# EAGLE schematic bottom (EAGLE 7.7.0)
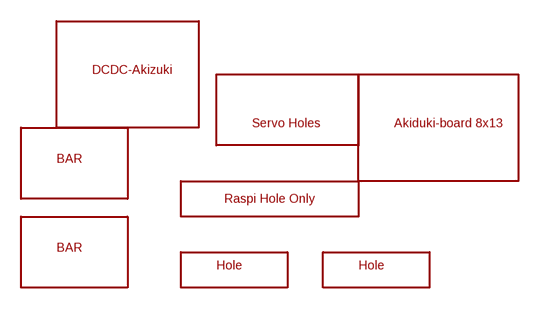
[diagram p0: schematic, sheet 1]

## Parts
U$1  RPI3-HOLE-ONLY  [RPI3-HOLE-ONLY]
U$2  SQUARE_LONG_HOLE  [SQUARE_LONG_HOLE]
U$3  SQUARE_LONG_HOLE  [SQUARE_LONG_HOLE]
U$12  BAR  [BAR]
U$13  BAR  [BAR]
U$14  SERVO-HOLES  [SERVO-HOLES]
U$18  DCDC-AKIZUKI  [DCDC_AKIZUKI]
U$19  AKIDUKI-BOARD8X13  [AKIDUKI-UNI-BOARD]

## Library data of the parts
U$1 = 0_Rpi3_RevA:RPI3-HOLE-ONLY
U$2 U$3 = 0_Rpi3_RevA:SQUARE_LONG_HOLE
U$12 U$13 = 0-chirimen:BAR
U$14 = 0-chirimen:SERVO-HOLES
U$18 = 0-chirimen:DCDC-AKIZUKI
U$19 = 0-chirimen:AKIDUKI-BOARD8X13